# EAGLE design satsha-ttl (EAGLE 8.4.3)
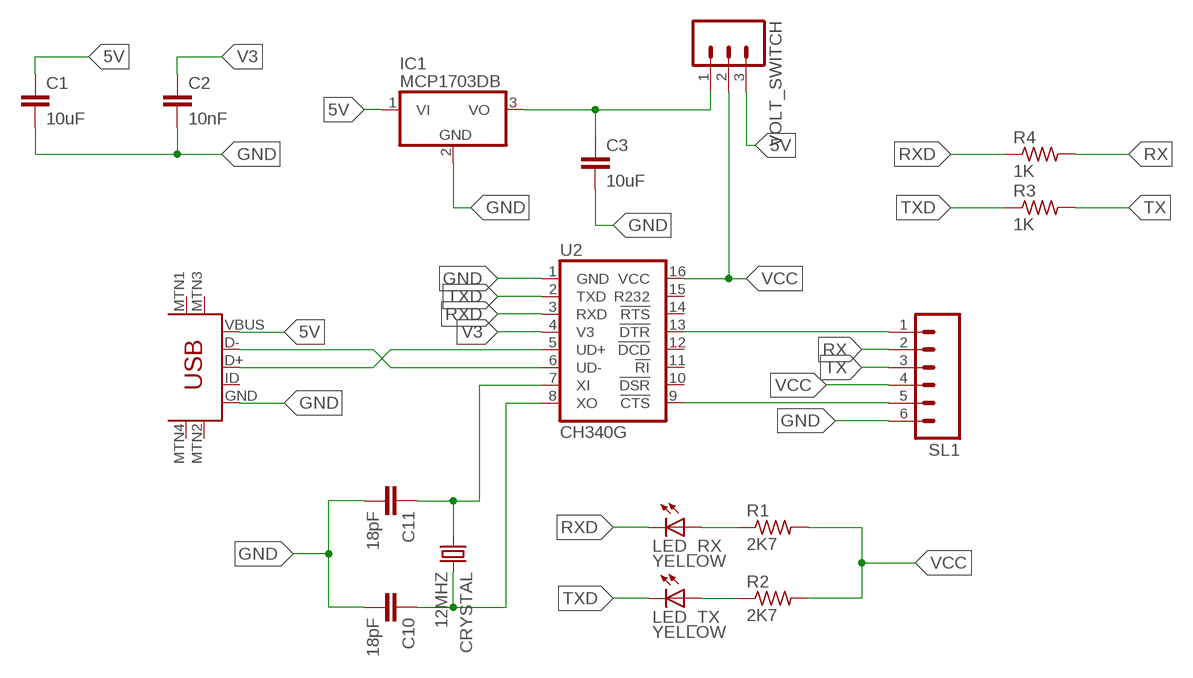
[diagram p0: schematic, sheet 1]

## Parts
C1  10uF  CAP1206  [1206]
C2  10nF  CAP1206  [1206]
C3  10uF  CAP1206  [1206]
C10  18pF  CAP1206  [1206]
C11  18pF  CAP1206  [1206]
CRYSTAL  12MHZ  CSM-7X-DU  [CSM-7X-DU]
IC1  MCP1703DB  [SOT223]
LED_RX  YELLOW  LED  [LED1206]
LED_TX  YELLOW  LED  [LED1206]
R1  2K7  RES-US1206  [R1206]
R2  2K7  RES-US1206  [R1206]
R3  1K  RES-US1206  [R1206]
R4  1K  RES-US1206  [R1206]
SL1  M06  [06P]
U2  CH340G  CH340GSMD  [SO016]
U$7  USB-MINIB-5PIN  [USB-MINIB]
VOLT_SWITCH  M03  [03P]

## Nets
3V3: C3.1 IC1.3(VO) VOLT_SWITCH.1
5V: C1.1 IC1.1(VI) U$7.VBUS VOLT_SWITCH.3
CTS: SL1.5 U2.9(!CTS)
D+: U2.5(UD+) U$7.D+
D-: U2.6(UD-) U$7.D-
DTR: SL1.1 U2.13(!DTR)
GND: C1.2 C2.2 C3.2 C10.2 C11.2 IC1.2(GND) SL1.6 U2.1(GND) U$7.GND
N$6: LED_RX.1(A) R1.1
N$7: LED_TX.1(A) R2.1
OSC_IN: C10.1 CRYSTAL.2 U2.8(XO)
OSC_OUT: C11.1 CRYSTAL.1 U2.7(XI)
RX: R4.2 SL1.2
RXD: LED_RX.2(C) R4.1 U2.3(RXD)
TX: R3.2 SL1.3
TXD: LED_TX.2(C) R3.1 U2.2(TXD)
V3: C2.1 U2.4(V3)
VCC: R1.2 R2.2 SL1.4 U2.16(VCC) VOLT_SWITCH.2
Unconnected: U2.10(!DSR) U2.11(!RI) U2.12(!DCD) U2.14(!RTS) U2.15(R232) U$7.ID U$7.MTN1(MTN2) U$7.MTN2(MTN3) U$7.MTN3(MTN1) U$7.MTN4

## Library data of the parts
C1-C3 C10 C11 = 01_SparkFun:CAP: Capacitor Standard 0603 ceramic capacitor, and 0.1" leaded capacitor.
CRYSTAL = flight_controller.lbr01_FAB_Hello:CSM-7X-DU: SMD CRYSTAL Source: www.ecsxtal.com .. Crystal 3.6864MHz CSM_7X_DU.PDF; OC_FARNELL: unknown; OC_NEWARK: unknown
IC1 = linear:MCP1703: 250 mA, 16V, Low Quiescent Current LDO Regulator Source: http://ww1.microchip.com/downloads/en/DeviceDoc/22049b.pdf
LED_RX LED_TX = fab:LED: LED
R1-R4 = fab:RES-US: Resistor (US Symbol) Variants with postfix FAB are widened to allow the routing of internal traces
SL1 = con-amp-quick:M06: AMP QUICK CONNECTOR; OC_FARNELL: unknown; OC_NEWARK: unknown
U2 = SparkFun-DigitalIC:CH340G: A simple USB 2.0 to Serial IC.; PROD_ID: IC-13498
U$7 = SparkFun:USB-MINIB
VOLT_SWITCH = con-amp-quick:M03: AMP QUICK CONNECTOR; OC_FARNELL: unknown; OC_NEWARK: unknown

## Net classes
1 power: width 0.178 mm

## Board
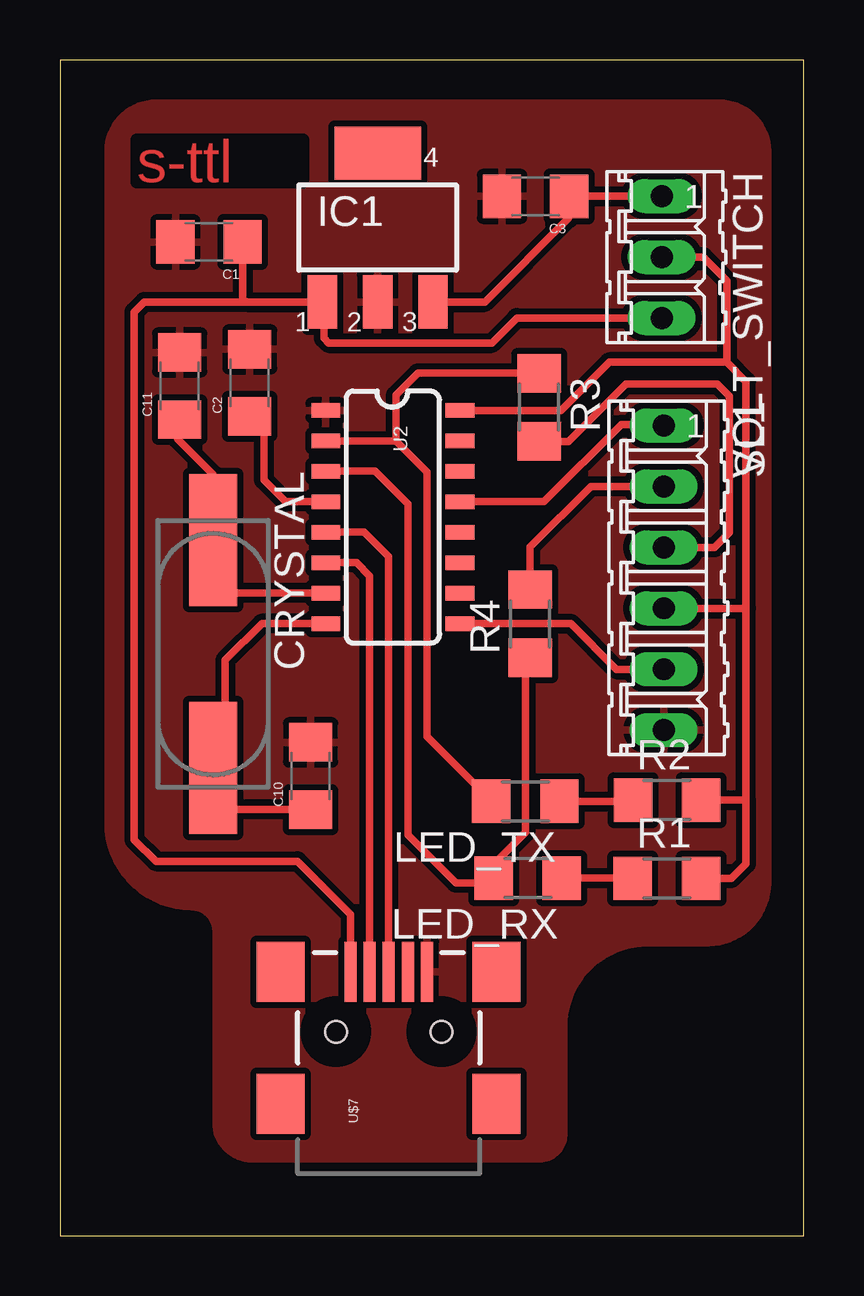
[diagram p1: board, top side]

Size 31 x 49 mm. Coordinates in mm from the lower left corner, seen from the top.
Outline: 0,0 31,0 31,49 0,49 0,0
Copper layers (1*16): Top 0.035mm / dielectric 1.5mm / Bottom 0.035mm
Design rules "default": minimum track width 6mil, minimum drill 0.35mm, track to track 6mil, track to pad 6mil, pad to pad 6mil, via to via 6mil, smd to smd 6mil, copper to edge 40mil, drill to drill 6mil, minimum pad ring 10mil, minimum via ring 8mil, stop-mask expansion 4mil, vias tented up to drill 0mil, thermal gap 10mil

### Footprints (pad centres in the part's own frame; a part is rotated, then mirrored left to right if it is on the bottom)
1206 = smd 1.6 x 1.8: 1 -1.4,0; 2 1.4,0
CSM-7X-DU = smd 5.5 x 2: 1 -4.75,0; 2 4.75,0
SOT223 = smd 1.219 x 2.235: 1 -2.311,-3.099; 2 0,-3.099; 3 2.311,-3.099 | smd 3.6 x 2.2: 4 0,3.099
LED1206 = smd 1.6 x 1.803: 1 -1.422,0; 2 1.422,0
R1206 = smd 1.6 x 1.803: 1 -1.422,0; 2 1.422,0
06P = drill 0.914 long: 1 -6.35,0; 2 -3.81,0; 3 -1.27,0; 4 1.27,0; 5 3.81,0; 6 6.35,0
SO016 = smd 0.6 x 1.2: 1 -4.445,-2.8; 2 -3.175,-2.8; 3 -1.905,-2.8; 4 -0.635,-2.8; 5 0.635,-2.8; 6 1.905,-2.8; 7 3.175,-2.8; 8 4.445,-2.8; 9 4.445,2.8; 10 3.175,2.8; 11 1.905,2.8; 12 0.635,2.8; 13 -0.635,2.8; 14 -1.905,2.8; 15 -3.175,2.8; 16 -4.445,2.8
USB-MINIB = smd 2.5 x 0.5: D+ 2.5,0; D- 2.5,0.8; GND 2.5,-1.6; ID 2.5,-0.8; VBUS 2.5,1.6 | smd 2.5 x 2: MTN1 -3,4.5; MTN2 2.5,4.5; MTN3 -3,-4.5; MTN4 2.5,-4.5 | hole 0.9: 0,2.2; 0,-2.2
03P = drill 0.914 long: 1 -2.54,0; 2 0,0; 3 2.54,0

### Placement (x,y rotation side)
C1  6.21,41.41 180 top
C2  7.91,35.54 90 top
C3  19.83,43.31 180 top
C10  10.45,19.16 90 top
C11  4.99,35.41 90 top
CRYSTAL  6.39,24.24 270 top
IC1  13.25,42.02 0 top
LED_RX  19.5,14.9 180 top
LED_TX  19.4,18.1 180 top
R1  25.3,14.89 0 top
R2  25.31,18.15 0 top
R3  19.98,34.52 270 top
R4  19.6,25.51 90 top
SL1  25.17,27.42 270 top
U2  13.88,29.95 270 top
U$7  13.71,8.49 90 top
VOLT_SWITCH  25.09,40.79 270 top

### Tracks (layer width: path | path; a pad name or v marks a point on that pad's centre or on a via)
3V3
  Top 0.305: VOLT_SWITCH.1 21.24,43.33 C3.1 21.23,42.83 21.2,42.8 21.2,42.4 17.72,38.92 IC1.3
5V
  Top 0.305: 10.85,39.04 10.73,39.22 | 10.85,39.04 IC1.1 11,38.85 11,37.4 11.2,37.2 18,37.2 19.05,38.25 VOLT_SWITCH.3 | U$7.VBUS 12.11,13.39 9.9,15.6 4,15.6 3.1,16.5 3.1,38.5 3.52,38.92 7.8,38.92 | 7.8,38.92 10.73,38.92 arc90 10.85,39.04 | C1.1 7.61,39.1 arc90 7.8,38.92
CTS
  Top 0.305: U2.9 21.3,25.51 23.2,23.6 SL1.5
D+
  Top 0.305: U$7.D+ 13.71,28.29 12.69,29.32 U2.5
D-
  Top 0.305: 11.08,28.08 U2.6 12.36,28.05 12.91,27.49 U$7.D-
DTR
  Top 0.305: U2.13 20.19,30.59 23.4,33.8 25.13,33.8 SL1.1
GND
  pour Top (isolate 0.265): 2,45.2 2,17.2 arc90 5.5,13.7 arc-90 6.5,12.7 6.5,4.7 arc90 8,3.2 20,3.2 arc90 21,4.2 21,8.7 arc-90 24.5,12.2 27,12.2 arc90 29.5,14.7 29.5,45.2 arc90 27.5,47.2 4,47.2 arc90
N$6
  Top 0.305: LED_RX.1 23.87,14.9 R1.1
N$7
  Top 0.305: LED_TX.1 23.84,18.1 R2.1
OSC_IN
  Top 0.305: C10.1 6.64,17.76 6.51,17.63 6.51,19.16 | 6.51,19.16 6.51,19.36 CRYSTAL.2 | U2.8 8.42,25.51 6.89,23.98 6.89,19.54 6.51,19.16
OSC_OUT
  Top 0.305: U2.7 6.51,26.78 6.39,26.65 CRYSTAL.1 6.39,31.71 4.9,33.2 4.9,33.92 C11.1
RX
  Top 0.305: SL1.2 22.12,31.23 19.6,28.7 R4.2
RXD
  Top 0.305: 19.4,23.89 R4.1 | 19.3,23.78 R4.1 | U2.3 13.15,31.86 14.5,30.5 14.5,16.7 16.5,14.7 17.88,14.7 LED_RX.2 18.08,15.48 19.4,16.8 19.4,23.88 R4.1
TX
  Top 0.305: R3.2 21.2,33.1 23.6,35.5 27.4,35.5 27.9,35 27.9,29.3 27.29,28.69 SL1.3
TXD
  Top 0.305: R3.1 14.92,35.94 14.01,35.03 14.01,33.12 | U2.2 14.01,33.12 | 14.01,33.12 15.3,31.83 15.3,20.8 17.92,18.18 17.92,18.16 LED_TX.2
V3
  Top 0.305: U2.4 9.42,30.59 8.5,31.5 8.5,33.55 | 8.5,33.55 8.55,33.5 | 8.5,33.55 C2.1
VCC
  Top 0.305: U2.16 20.89,34.4 22.9,36.4 27.8,36.4 | 27.8,36.4 28.6,35.6 28.6,26.15 | VOLT_SWITCH.2 26.82,40.79 27.8,39.8 27.8,36.4 | R1.2 27.99,14.89 28.6,15.5 28.6,18.15 | SL1.4 28.6,26.15 | 28.6,18.15 28.6,26.15 | R2.2 28.6,18.15

### Text on the board
Top: s-ttl